# EAGLE design Camera-Board (EAGLE 8.0.0)

## Sheet 1 of 2: Template
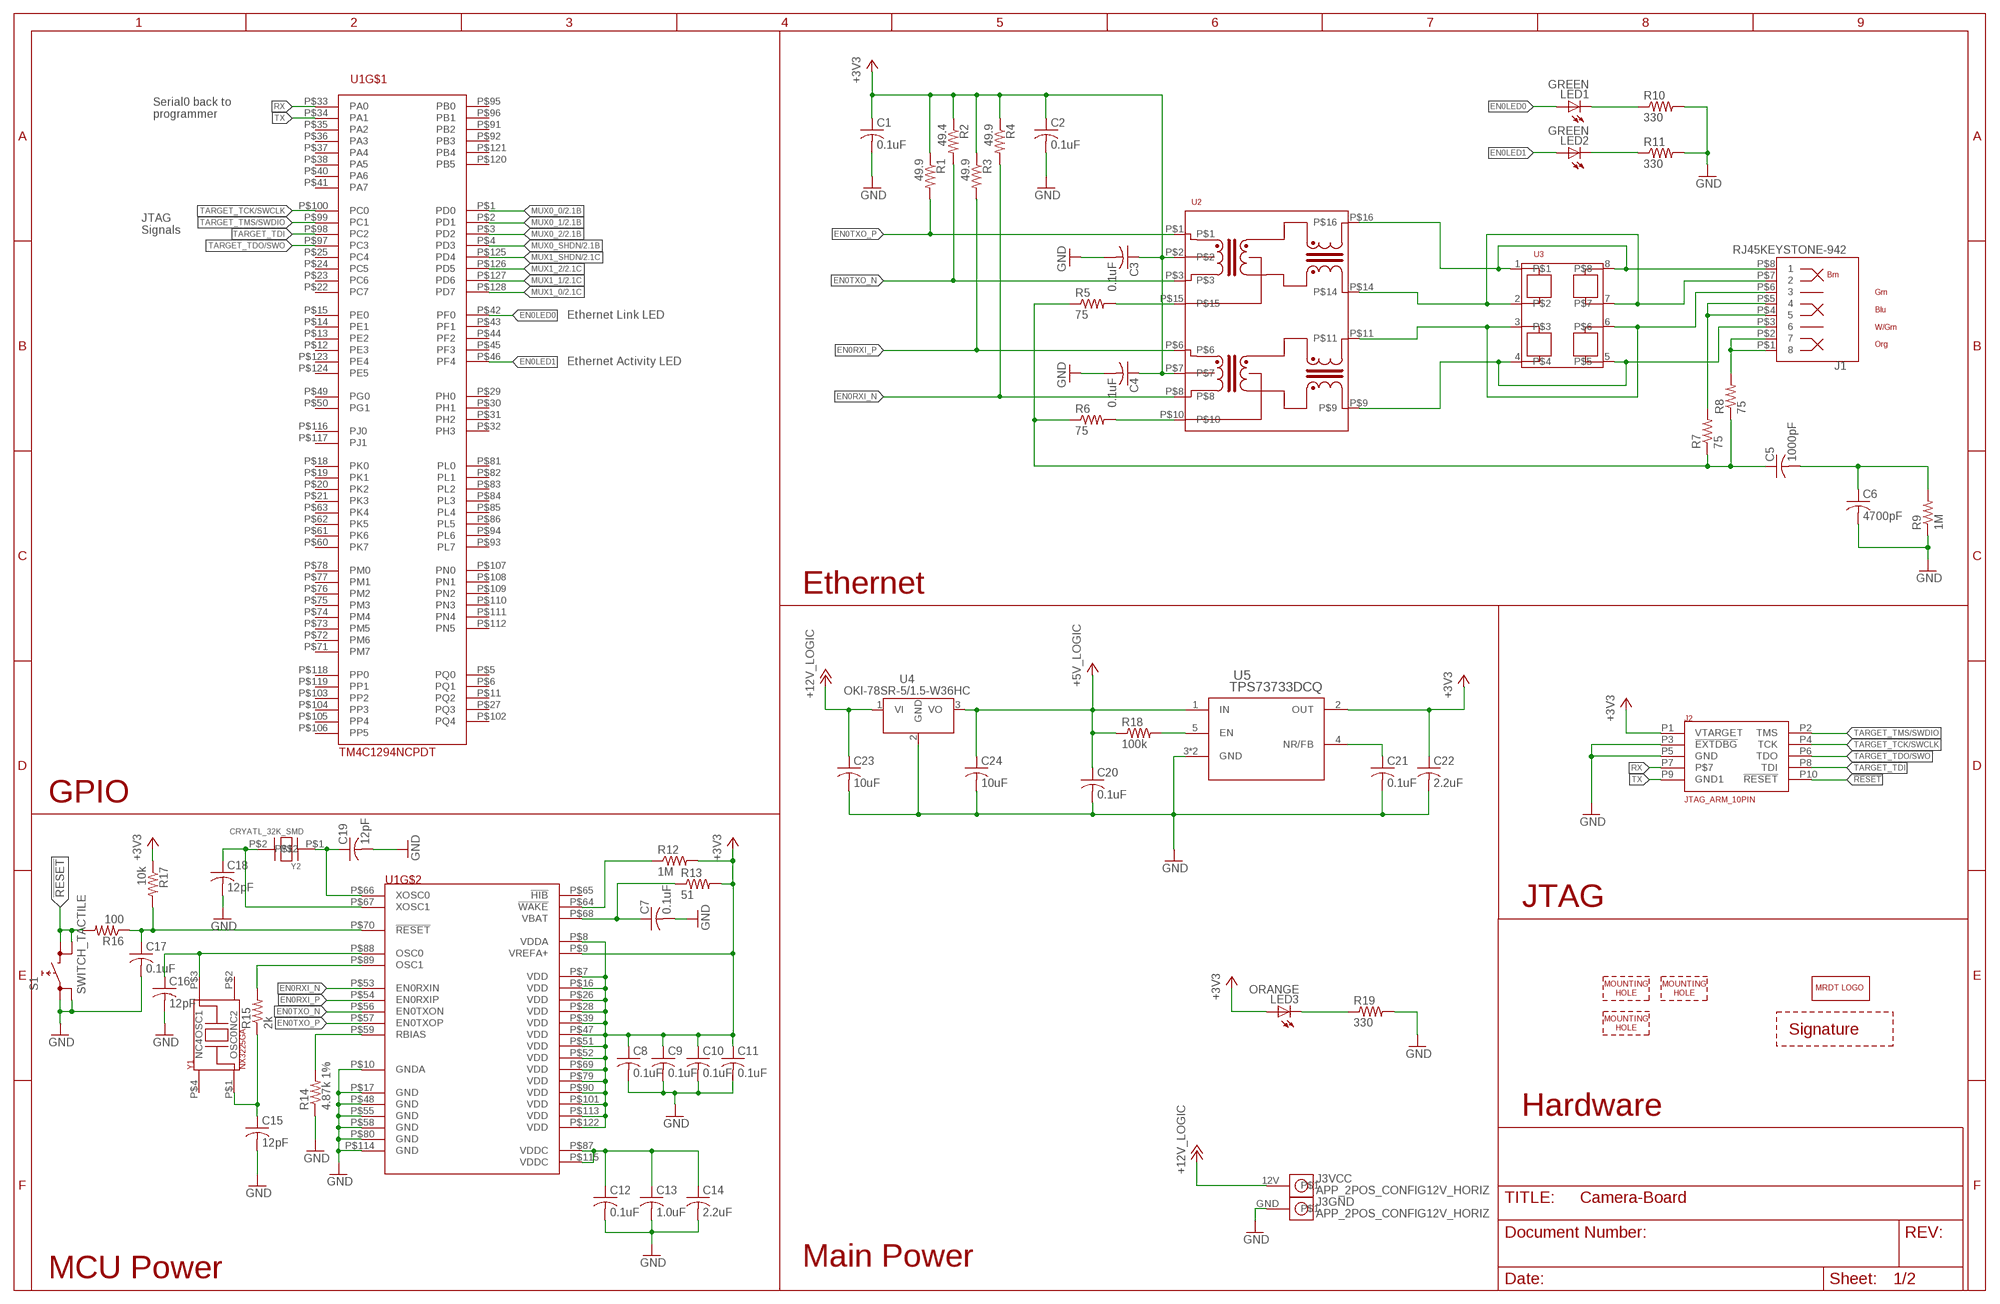
[diagram p0: schematic, sheet 1]

### Parts
C1  0.1uF  C-USC0603  [C0603]
C2  0.1uF  C-USC0603  [C0603]
C3  0.1uF  C-USC0603  [C0603]
C4  0.1uF  C-USC0603  [C0603]
C5  1000pF  C-USC0603  [C0603]
C6  4700pF  C-USC1206  [C1206]
C7  0.1uF  C-USC0603  [C0603]
C8  0.1uF  C-USC0603  [C0603]
C9  0.1uF  C-USC0603  [C0603]
C10  0.1uF  C-USC0603  [C0603]
C11  0.1uF  C-USC0603  [C0603]
C12  0.1uF  C-USC0603  [C0603]
C13  1.0uF  C-USC0603  [C0603]
C14  2.2uF  C-USC0603  [C0603]
C15  12pF  C-USC0603  [C0603]
C16  12pF  C-USC0603  [C0603]
C17  0.1uF  C-USC0603  [C0603]
C18  12pF  C-USC0603  [C0603]
C19  12pF  C-USC0603  [C0603]
C20  0.1uF  C-USC0603  [C0603]
C21  0.1uF  C-USC0603  [C0603]
C22  2.2uF  C-USC0603  [C0603]
C23  10uF  C-USC1206  [C1206]
C24  10uF  C-USC1206  [C1206]
J1  RJ45KEYSTONE-942  [KEYSTONE-942]
J2  JTAG_ARM_10PIN  [CON_2X5_50MIL]
J3  APP_2POS_CONFIG12V_HORIZ  [APP45_12V_HORIZ_CONFIG]
LED1  GREEN  LEDCHIP-LED0603  [CHIP-LED0603]
LED2  GREEN  LEDCHIP-LED0603  [CHIP-LED0603]
LED3  ORANGE  LEDCHIP-LED0603  [CHIP-LED0603]
R1  49.9  R-US_R0603  [R0603]
R2  49.4  R-US_R0603  [R0603]
R3  49.9  R-US_R0603  [R0603]
R4  49.9  R-US_R0603  [R0603]
R5  75  R-US_R0603  [R0603]
R6  75  R-US_R0603  [R0603]
R7  75  R-US_R0603  [R0603]
R8  75  R-US_R0603  [R0603]
R9  1M  R-US_R1206  [R1206]
R10  330  R-US_R0603  [R0603]
R11  330  R-US_R0603  [R0603]
R12  1M  R-US_R0603  [R0603]
R13  51  R-US_R0603  [R0603]
R14  4.87k 1%  R-US_R0603  [R0603]
R15  2k  R-US_R0603  [R0603]
R16  100  R-US_R0603  [R0603]
R17  10k  R-US_R0603  [R0603]
R18  100k  R-US_R0603  [R0603]
R19  330  R-US_R0603  [R0603]
S1  SWITCH_TACTILE  [SWITCH_6MM_6MM_TE_CON_SMD]
U1  TM4C1294NCPDT  [TQFP-128]
U2  HX1198FNL  [HX1198FNL]
U3  SLVU2.8-4  [SOIC8]
U4  OKI-78SR-5/1.5-W36HC  [OKI-78SR_HORIZ]
U5  TPS73733DCQ  [SOT-223-6]
U$1  MRDT_LOGO  [MRDT_LOGO]
U$2  MOUNTING_HOLE#6  [#6_SCREW]
U$3  MOUNTING_HOLE#6  [#6_SCREW]
U$4  MOUNTING_HOLE#6  [#6_SCREW]
U$8  SIG3  [SIG3]
Y1  NX3225GA  [NDK3.2X2.5]
Y2  CRYATL_32K_SMD  [CRYSTAL_32K_SMD]

### Nets
!RESET: J2.P10(!RESET) R16.2 S1.P$3 S1.P$4
+3V3: C1.1 C2.1 C3.1 C4.1 C8.1 C9.1 C10.1 C11.1 C22.1 J2.P1(VTARGET) LED3.A R1.1 R2.1 R3.1 R4.1 R12.2 R13.2 R17.1 U1.P$7(VDD) U1.P$8(VDDA) U1.P$9(VREFA+) U1.P$16(VDD) U1.P$26(VDD) U1.P$28(VDD) U1.P$39(VDD) U1.P$47(VDD) U1.P$51(VDD) U1.P$52(VDD) U1.P$69(VDD) U1.P$79(VDD) U1.P$90(VDD) U1.P$101(VDD) U1.P$113(VDD) U1.P$122(VDD) U2.P$2 U2.P$7 U5.2(OUT)
+5V_LOGIC: C20.1 C24.1 R18.1 U4.3(VO) U5.1(IN) ; also sheet 2
+12V_LOGIC: C23.1 J3.12V U4.1(VI)
EN0LED0: LED1.A U1.P$42(PF0)
EN0LED1: LED2.A U1.P$46(PF4)
EN0RXI_N [Ethernet]: R4.2 U1.P$53(EN0RXIN) U2.P$8
EN0RXI_P [Ethernet]: R3.2 U1.P$54(EN0RXIP) U2.P$6
EN0TXO_N [Ethernet]: R2.2 U1.P$56(EN0TXON) U2.P$3
EN0TXO_P [Ethernet]: R1.2 U1.P$57(EN0TXOP) U2.P$1
GND: C1.2 C2.2 C3.2 C4.2 C6.2 C7.2 C8.2 C9.2 C10.2 C11.2 C12.2 C13.2 C14.2 C15.2 C16.2 C17.2 C18.2 C19.2 C20.2 C21.2 C22.2 C23.2 C24.2 J2.P3(!EXTDBG) J2.P5(GND) J3.GND R9.1 R10.2 R11.2 R14.1 R19.2 S1.P$1 S1.P$2 U1.P$10(GNDA) U1.P$17(GND) U1.P$48(GND) U1.P$55(GND) U1.P$58(GND) U1.P$80(GND) U1.P$114(GND) U4.2(GND) U5.3(GND) U5.6(GND) ; also sheet 2
MUX0_0: U1.P$1(PD0) ; also sheet 2
MUX0_1: U1.P$2(PD1) ; also sheet 2
MUX0_2: U1.P$3(PD2) ; also sheet 2
MUX0_SHDN: U1.P$4(PD3) ; also sheet 2
MUX1_0: U1.P$128(PD7) ; also sheet 2
MUX1_1: U1.P$127(PD6) ; also sheet 2
MUX1_2: U1.P$126(PD5) ; also sheet 2
MUX1_SHDN: U1.P$125(PD4) ; also sheet 2
N_$1: R5.2 U2.P$15
N_$3: R6.2 U2.P$10
N_$4: J1.P$7 U2.P$14 U3.2 U3.7
N_$5: J1.P$6 U2.P$11 U3.3 U3.6
N_$6: J1.P$8 U2.P$16 U3.1 U3.8
N_$7: J1.P$3 U2.P$9 U3.4 U3.5
N_$8: LED2.C R11.1
N_$9: LED1.C R10.1
N_$10: C7.1 R13.1 U1.P$68(VBAT)
N_$11: J1.P$4 J1.P$5 R7.2
N_$12: R12.1 U1.P$64(!WAKE)
N_$13: J1.P$1 J1.P$2 R8.2
N_$14: C5.1 R5.1 R6.1 R7.1 R8.1
N_$15: C5.2 C6.1 R9.2
N_$16: C12.1 C13.1 C14.1 U1.P$87(VDDC) U1.P$115(VDDC)
N_$17: R15.2 U1.P$89(OSC1)
N_$18: C16.1 U1.P$88(OSC0) Y1.P$3(OSC1)
N_$19: R14.2 U1.P$59(RBIAS)
N_$20: C17.1 R16.1 R17.2 U1.P$70(!RESET)
N_$21: C15.1 R15.1 Y1.P$1(OSC0)
N_$22: C18.1 U1.P$67(XOSC1) Y2.P$2
N_$23: C19.1 U1.P$66(XOSC0) Y2.P$1
N_$25: R18.2 U5.5(EN)
N_$26: LED3.C R19.1
N_$27: C21.1 U5.4(NR/FB)
RX: J2.P7 U1.P$33(PA0)
TARGET_TCK/SWCLK: J2.P4(TCK) U1.P$100(PC0)
TARGET_TDI: J2.P8(TDI) U1.P$98(PC2)
TARGET_TDO/SWO: J2.P6(TDO) U1.P$97(PC3)
TARGET_TMS/SWDIO: J2.P2(TMS) U1.P$99(PC1)
TX: J2.P9(GND1) U1.P$34(PA1)
Unconnected: U1.P$5(PQ0) U1.P$6(PQ1) U1.P$11(PQ2) U1.P$12(PE3) U1.P$13(PE2) U1.P$14(PE1) U1.P$15(PE0) U1.P$18(PK0) U1.P$19(PK1) U1.P$20(PK2) U1.P$21(PK3) U1.P$22(PC7) U1.P$23(PC6) U1.P$24(PC5) U1.P$25(PC4) U1.P$27(PQ3) U1.P$29(PH0) U1.P$30(PH1) U1.P$31(PH2) U1.P$32(PH3) U1.P$35(PA2) U1.P$36(PA3) U1.P$37(PA4) U1.P$38(PA5) U1.P$40(PA6) U1.P$41(PA7) U1.P$43(PF1) U1.P$44(PF2) U1.P$45(PF3) U1.P$49(PG0) U1.P$50(PG1) U1.P$60(PK7) U1.P$61(PK6) U1.P$62(PK5) U1.P$63(PK4) U1.P$65(!HIB) U1.P$71(PM7) U1.P$72(PM6) U1.P$73(PM5) U1.P$74(PM4) U1.P$75(PM3) U1.P$76(PM2) U1.P$77(PM1) U1.P$78(PM0) U1.P$81(PL0) U1.P$82(PL1) U1.P$83(PL2) U1.P$84(PL3) U1.P$85(PL4) U1.P$86(PL5) U1.P$91(PB2) U1.P$92(PB3) U1.P$93(PL7) U1.P$94(PL6) U1.P$95(PB0) U1.P$96(PB1) U1.P$102(PQ4) U1.P$103(PP2) U1.P$104(PP3) U1.P$105(PP4) U1.P$106(PP5) U1.P$107(PN0) U1.P$108(PN1) U1.P$109(PN2) U1.P$110(PN3) U1.P$111(PN4) U1.P$112(PN5) U1.P$116(PJ0) U1.P$117(PJ1) U1.P$118(PP0) U1.P$119(PP1) U1.P$120(PB5) U1.P$121(PB4) U1.P$123(PE4) U1.P$124(PE5) Y1.P$2(NC2) Y1.P$4(NC4)

### Notes on the sheet
- Serial0 back to
  programmer
- JTAG
  Signals
- Ethernet Link LED
- Ethernet Activity LED
- Ethernet
- GPIO
- JTAG
- Hardware
- Main Power
- MCU Power

## Sheet 2 of 2: Camera Muxing
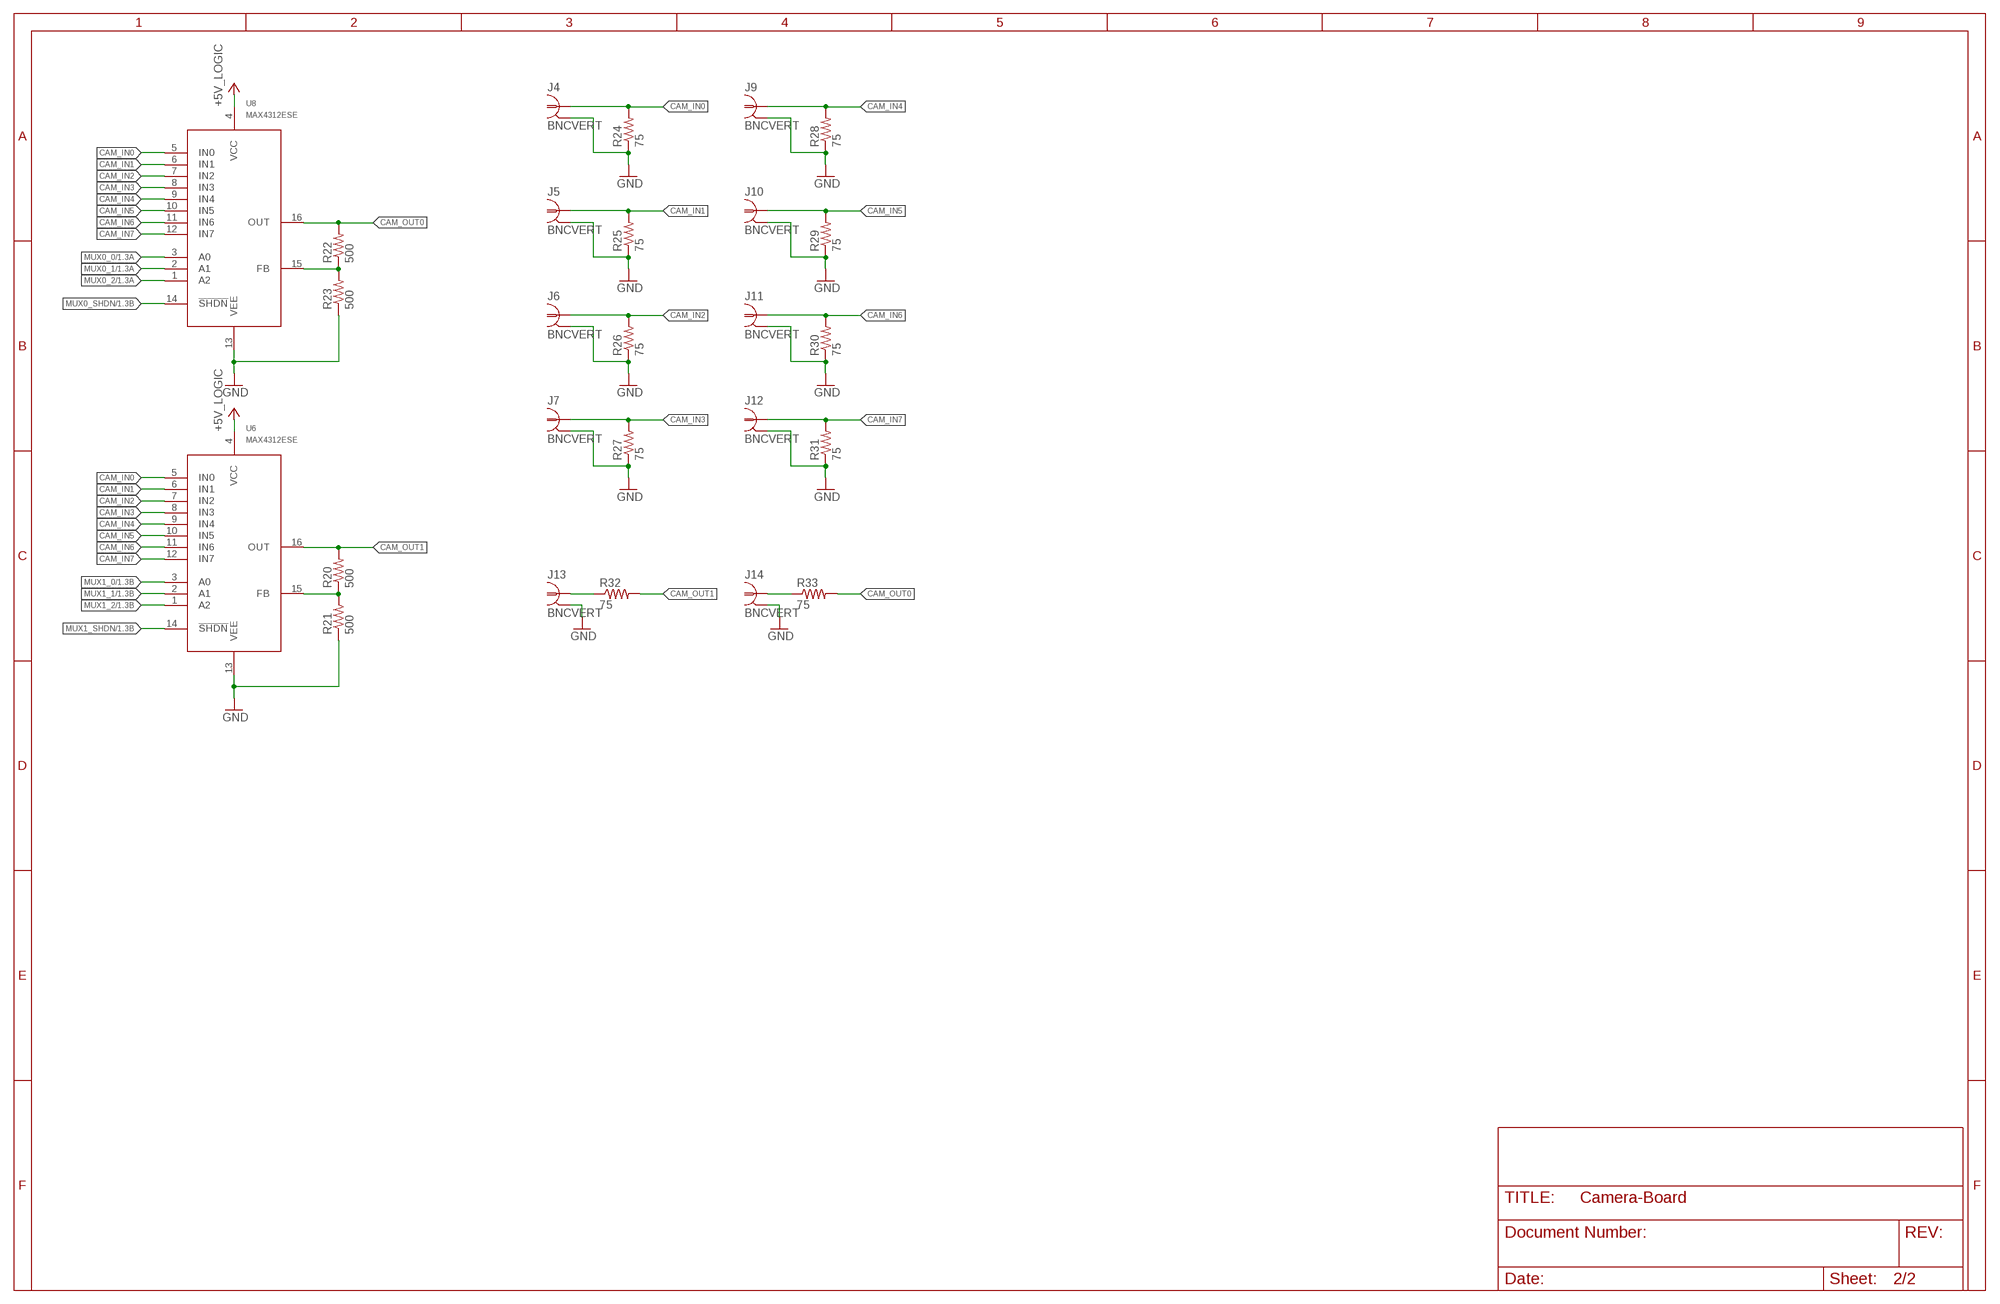
[diagram p1: schematic, sheet 2]

### Parts
J4  BNCVERT  [MOLEX-0731711900-BNC]
J5  BNCVERT  [MOLEX-0731711900-BNC]
J6  BNCVERT  [MOLEX-0731711900-BNC]
J7  BNCVERT  [MOLEX-0731711900-BNC]
J9  BNCVERT  [MOLEX-0731711900-BNC]
J10  BNCVERT  [MOLEX-0731711900-BNC]
J11  BNCVERT  [MOLEX-0731711900-BNC]
J12  BNCVERT  [MOLEX-0731711900-BNC]
J13  BNCVERT  [MOLEX-0731711900-BNC]
J14  BNCVERT  [MOLEX-0731711900-BNC]
R20  500  R-US_R0603  [R0603]
R21  500  R-US_R0603  [R0603]
R22  500  R-US_R0603  [R0603]
R23  500  R-US_R0603  [R0603]
R24  75  R-US_R0603  [R0603]
R25  75  R-US_R0603  [R0603]
R26  75  R-US_R0603  [R0603]
R27  75  R-US_R0603  [R0603]
R28  75  R-US_R0603  [R0603]
R29  75  R-US_R0603  [R0603]
R30  75  R-US_R0603  [R0603]
R31  75  R-US_R0603  [R0603]
R32  75  R-US_R0603  [R0603]
R33  75  R-US_R0603  [R0603]
U6  MAX4312ESE  [SOIC16]
U8  MAX4312ESE  [SOIC16]

### Nets
+5V_LOGIC: U6.4(VCC) U8.4(VCC) ; also sheet 1
CAM_IN0: J4.P$1 R24.2 U6.5(IN0) U8.5(IN0)
CAM_IN1: J5.P$1 R25.2 U6.6(IN1) U8.6(IN1)
CAM_IN2: J6.P$1 R26.2 U6.7(IN2) U8.7(IN2)
CAM_IN3: J7.P$1 R27.2 U6.8(IN3) U8.8(IN3)
CAM_IN4: J9.P$1 R28.2 U6.9(IN4) U8.9(IN4)
CAM_IN5: J10.P$1 R29.2 U6.10(IN5) U8.10(IN5)
CAM_IN6: J11.P$1 R30.2 U6.11(IN6) U8.11(IN6)
CAM_IN7: J12.P$1 R31.2 U6.12(IN7) U8.12(IN7)
CAM_OUT0: R22.2 R33.2 U8.16(OUT)
CAM_OUT1: R20.2 R32.2 U6.16(OUT)
GND: J4.P$2 J4.P$3 J4.P$4 J4.P$5 J5.P$2 J5.P$3 J5.P$4 J5.P$5 J6.P$2 J6.P$3 J6.P$4 J6.P$5 J7.P$2 J7.P$3 J7.P$4 J7.P$5 J9.P$2 J9.P$3 J9.P$4 J9.P$5 J10.P$2 J10.P$3 J10.P$4 J10.P$5 J11.P$2 J11.P$3 J11.P$4 J11.P$5 J12.P$2 J12.P$3 J12.P$4 J12.P$5 J13.P$2 J13.P$3 J13.P$4 J13.P$5 J14.P$2 J14.P$3 J14.P$4 J14.P$5 R21.1 R23.1 R24.1 R25.1 R26.1 R27.1 R28.1 R29.1 R30.1 R31.1 U6.13(VEE) U8.13(VEE) ; also sheet 1
MUX0_0: U8.3(A0) ; also sheet 1
MUX0_1: U8.2(A1) ; also sheet 1
MUX0_2: U8.1(A2) ; also sheet 1
MUX0_SHDN: U8.14(!SHDN) ; also sheet 1
MUX1_0: U6.3(A0) ; also sheet 1
MUX1_1: U6.2(A1) ; also sheet 1
MUX1_2: U6.1(A2) ; also sheet 1
MUX1_SHDN: U6.14(!SHDN) ; also sheet 1
N$1: R20.1 R21.2 U6.15(FB)
N$2: R22.1 R23.2 U8.15(FB)
N$3: J14.P$1 R33.1
N$4: J13.P$1 R32.1

## Library data of the parts
C1-C24 = resistor:C-US: CAPACITOR, American symbol
J1 = MRDT-Connectors:RJ45
J2 = MRDT-Connectors:JTAG_ARM_10PIN; PARTNO: M50-3600542
J3 = MRDT-Connectors:APP_2POS_CONFIG; COLOR1: YELLOW; COLOR2: BLACK
J4-J7 J9-J14 = MRDT-Connectors:BNC
LED1-LED3 = led:LED: LED OSRAM: - CHIPLED LG R971, LG N971, LY N971, LG Q971, LY Q971, LO R971, LY R971 LH N974, LH R974 LS Q976, LO Q976, LY Q976 LO Q996 - Hyper CHIPLED LW Q18S LB Q993, LB Q99A, LB R99A - SideLED LS A670, LO A670, LY A670, LG A670, LP A670 LB A673, LV A673, LT A673, LW A673 LH A674 LY A675 LS A676, LA A676, LO A676, LY A676, LW A676 LS A679, LY A679, LG A679 - Hyper Micro SIDELED® LS Y876, LA Y876, LO Y876, LY Y876 LT Y87S - SmartLED LW L88C, LW L88S LB L89C, LB L89S, LG L890 LS L89K, LO L89K, LY L89K LS L896, LA L896, LO L896, LY L896 - TOPLED LS T670, LO T670, LY T670, LG T670, LP T670 LSG T670, LSP T670, LSY T670, LOP T670, LYG T670 LG T671, LOG T671, LSG T671 LB T673, LV T673, LT T673, LW T673 LH T674 LS T676, LA T676, LO T676, LY T676, LB T676, LH T676, LSB T676, LW T676 LB T67C, LV T67C, LT T67C, LS T67K, LO T67K, LY T67K, LW E67C LS E67B, LA E67B, LO E67B, LY E67B, LB E67C, LV E67C, LT E67C LW T67C LS T679, LY T679, LG T679 LS T770, LO T770, LY T770, LG T770, LP T770 LB T773, LV T773, LT T773, LW T773 LH T774 LS E675, LA E675, LY E675, LS T675 LS T776, LA T776, LO T776, LY T776, LB T776 LHGB T686 LT T68C, LB T68C - Hyper Mini TOPLED® LB M676 - Mini TOPLED Santana® LG M470 LS M47K, LO M47K, LY M47K Source: http://www.osram.convergy.de LUXEON: - LUMILED® LXK2-PW12-R00, LXK2-PW12-S00, LXK2-PW14-U00, LXK2-PW14-V00 LXK2-PM12-R00, LXK2-PM12-S00, LXK2-PM14-U00 LXK2-PE12-Q00, LXK2-PE12-R00, LXK2-PE12-S00, LXK2-PE14-T00, LXK2-PE14-U00 LXK2-PB12-K00, LXK2-PB12-L00, LXK2-PB12-M00, LXK2-PB14-N00, LXK2-PB14-P00, LXK2-PB14-Q00 LXK2-PR12-L00, LXK2-PR12-M00, LXK2-PR14-Q00, LXK2-PR14-R00 LXK2-PD12-Q00, LXK2-PD12-R00, LXK2-PD12-S00 LXK2-PH12-R00, LXK2-PH12-S00 LXK2-PL12-P00, LXK2-PL12-Q00, LXK2-PL12-R00 Source: www.luxeon.com KINGBRIGHT: KA-3528ASYC Source: www.kingbright.com
R1 = rcl:R-US_: RESISTOR, American symbol
R2-R33 = resistor:R-US_: RESISTOR, American symbol
S1 = MRDT-UserInput:SWITCH_TACTILE
U1 = MRDT-Microcontrollers:TM4C1294NCPDT
U2 = MRDT-ICs:HX1198FNL
U3 = MRDT-ICs:SLVU2.8-4
U4 = MRDT-ICs:OKI-78SR-*/1.5-W36?C: 4.95W DC/DC Converter Manufacturer: Murata; VOUT: +5v
U5 = MRDT-ICs:TPS73733*: LDO with Reverse Current Protection
U6 U8 = MRDT-ICs:MAX4312E?E
U$1 = MRDT-Hardware:MRDT_LOGO
U$2-U$4 = MRDT-Hardware:MOUNTING_HOLE: Mounting hole for M6 bolt. Standard use mounting hole for: Tiva C Connected - M6 Anderson Powerpole Mounting Wing - M8 Most frame-mounted PCB's - M8
U$8 = sig:SIG
Y1 = MRDT-Passives:NX3225GA
Y2 = MRDT-Passives:CRYATL_32K_SMD

## Net classes
2 Ethernet: width 0.22 mm, clearance 0.152 mm

## Board
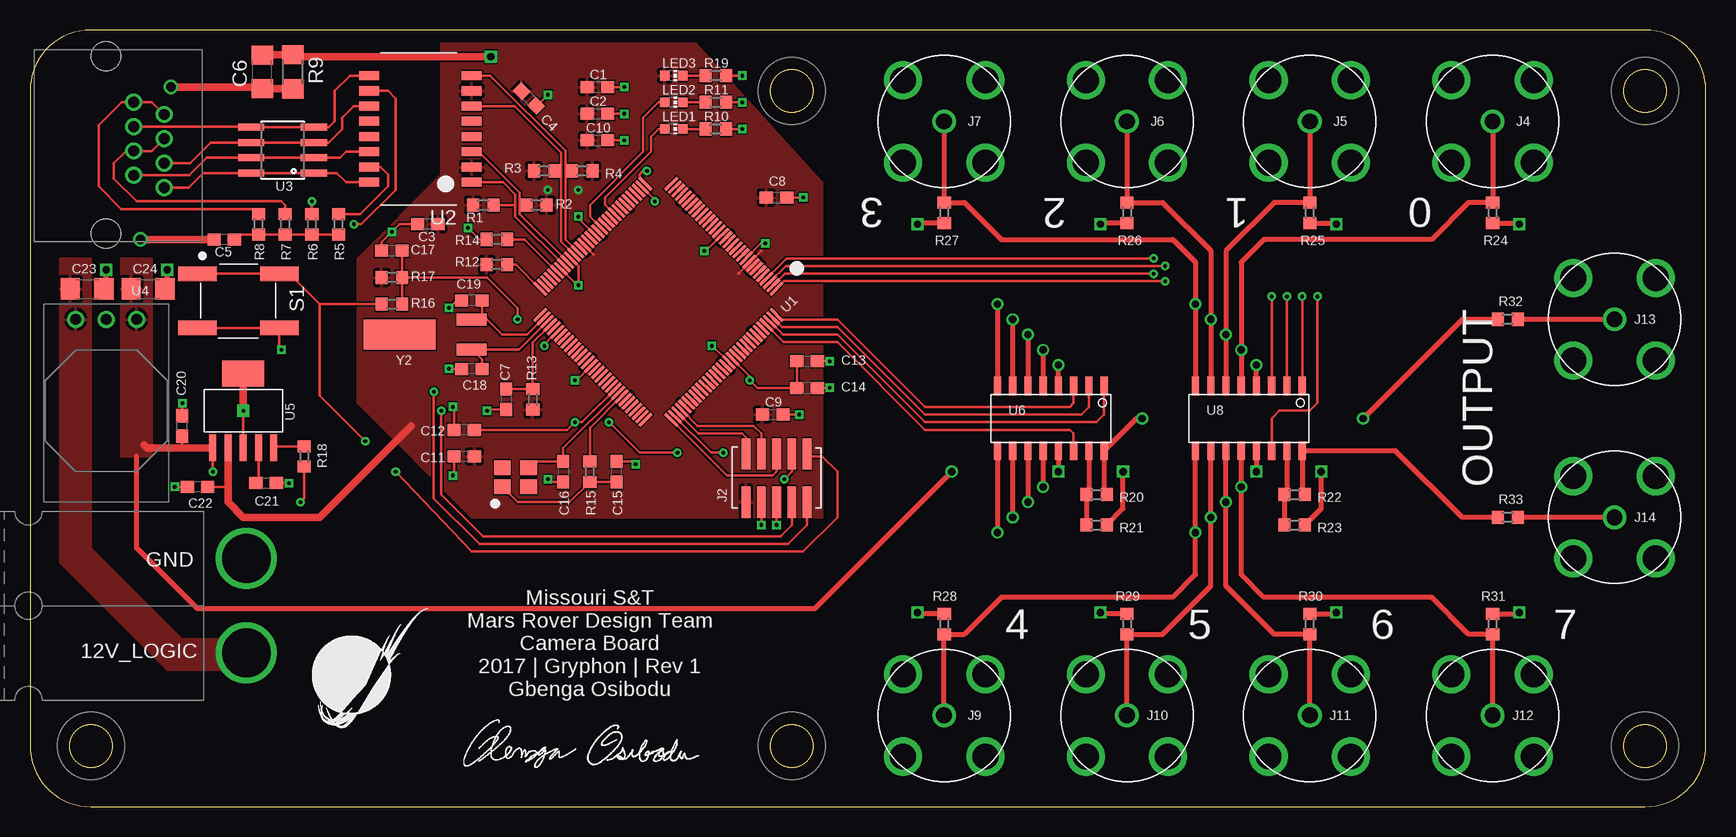
[diagram p2: board, top side]
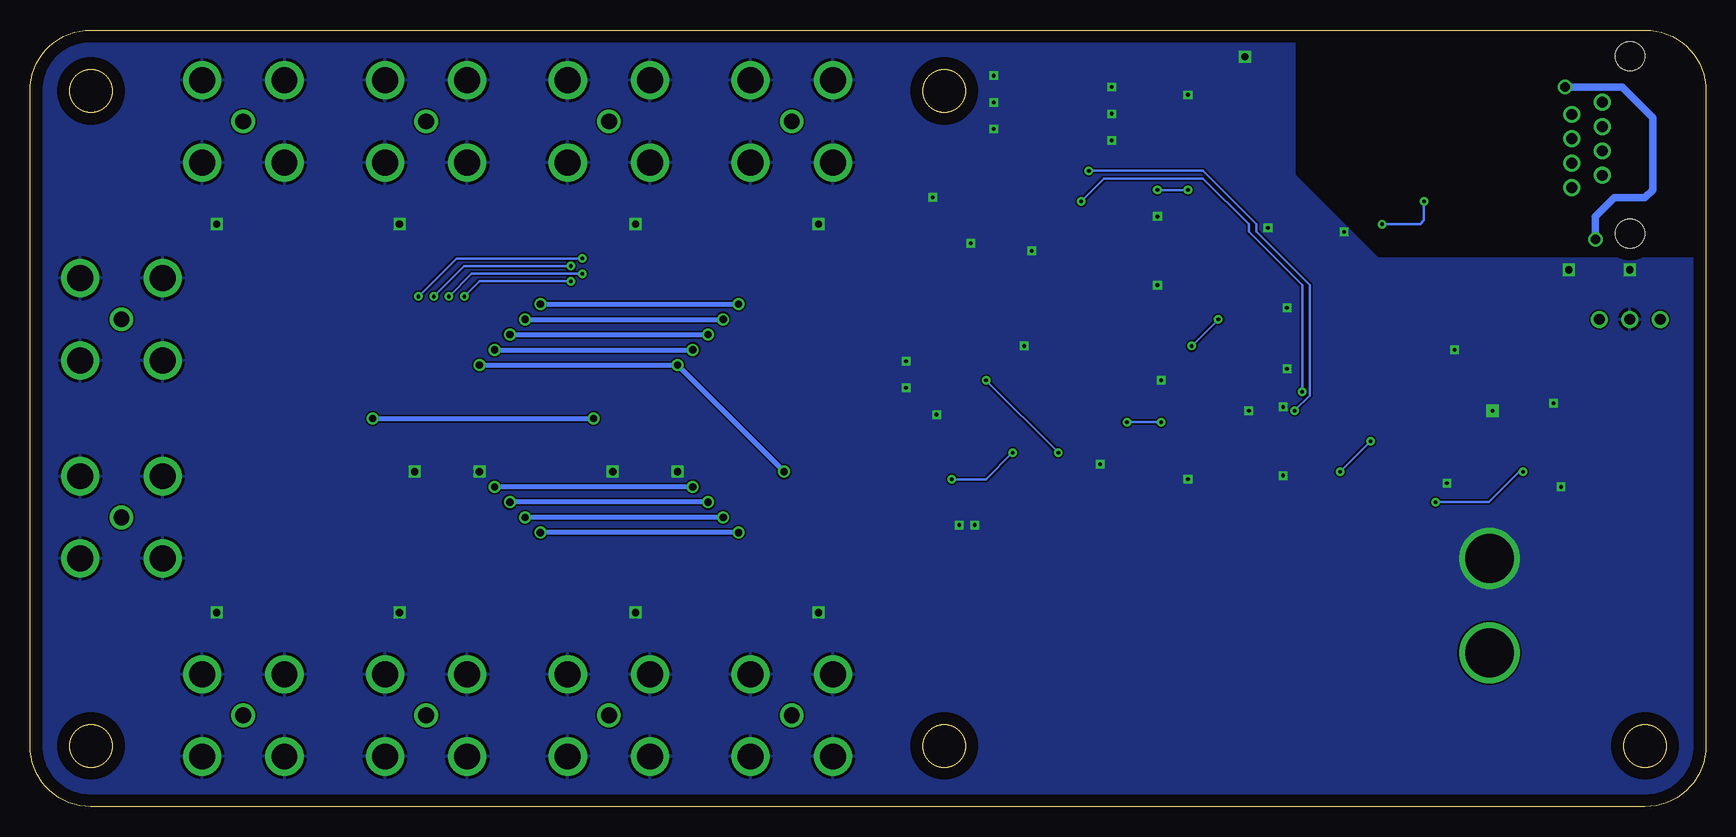
[diagram p3: board, bottom side, seen from below]

Size 139.7 x 64.77 mm. Coordinates in mm from the lower left corner, seen from the top.
Outline: 134.62,64.77 5.08,64.77 arc90 0,59.69 0,5.08 arc90 5.08,0 134.62,0 arc90 139.7,5.08 139.7,59.69 arc90 134.62,64.77
Copper layers (1*16): Top 0.035mm / dielectric 1.5mm / Bottom 0.035mm
Design rules "advanced_circuits_standard *": minimum track width 5mil, minimum drill 10mil, track to track 5mil, track to pad 5mil, pad to pad 5mil, via to via 5mil, smd to smd 5mil, copper to edge 40mil, drill to drill 5mil, minimum pad ring 10mil, minimum via ring 8mil, stop-mask expansion 4mil, vias tented up to drill 0mil, thermal gap 10mil

### Footprints (pad centres in the part's own frame; a part is rotated, then mirrored left to right if it is on the bottom)
C0603 = smd 1.1 x 1: 1 -0.85,0; 2 0.85,0
C1206 = smd 1.6 x 1.8: 1 -1.4,0; 2 1.4,0
KEYSTONE-942 = drill 0.9: P$1 3.8,2.289; P$2 4.816,4.829; P$3 5.832,2.289; P$4 6.848,4.829; P$5 7.864,2.289; P$6 8.88,4.829; P$7 9.896,2.289; P$8 10.912,4.829 | hole 2.413: -0.023,-0.023; 14.76,-0.023
CON_2X5_50MIL = smd 0.74 x 2.6: P1 0,0; P2 0,4.008; P3 1.27,0; P4 1.27,4.008; P5 2.54,0; P6 2.54,4.008; P7 3.81,0; P8 3.81,4.008; P9 5.08,0; P10 5.08,4.008
APP45_12V_HORIZ_CONFIG = drill 4.064: 12V 28.194,3.937; GND 28.194,11.811
MOLEX-0731711900-BNC = drill 1.32: P$1 0,0 | drill 2.16: P$2 -3.43,3.43; P$3 3.43,3.43; P$4 3.43,-3.43; P$5 -3.43,-3.43
CHIP-LED0603 = smd 0.8 x 0.8: A 0,-0.75; C 0,0.75
R0603 = smd 1 x 1.1: 1 -0.85,0; 2 0.85,0
R1206 = smd 1.6 x 1.803: 1 -1.422,0; 2 1.422,0
SWITCH_6MM_6MM_TE_CON_SMD = smd 1.2 x 3.2: P$1 4.521,6.807; P$2 4.521,0; P$3 0,6.807; P$4 0,0
TQFP-128 = smd 1.45 x 0.25: P$1 0,0; P$2 0,-0.4; P$3 0,-0.8; P$4 0,-1.2; P$5 0,-1.6; P$6 0,-2; P$7 0,-2.4; P$8 0,-2.8; P$9 0,-3.2; P$10 0,-3.6; P$11 0,-4; P$12 0,-4.4; P$13 0,-4.8; P$14 0,-5.2; P$15 0,-5.6; P$16 0,-6; P$17 0,-6.4; P$18 0,-6.8; P$19 0,-7.2; P$20 0,-7.6; P$21 0,-8; P$22 0,-8.4; P$23 0,-8.8; P$24 0,-9.2; P$25 0,-9.6; P$26 0,-10; P$27 0,-10.4; P$28 0,-10.8; P$29 0,-11.2; P$30 0,-11.6; P$31 0,-12; P$32 0,-12.4; P$65 15.45,-12.4; P$66 15.45,-12; P$67 15.45,-11.6; P$68 15.45,-11.2; P$69 15.45,-10.8; P$70 15.45,-10.4; P$71 15.45,-10; P$72 15.45,-9.6; P$73 15.45,-9.2; P$74 15.45,-8.8; P$75 15.45,-8.4; P$76 15.45,-8; P$77 15.45,-7.6; P$78 15.45,-7.2; P$79 15.45,-6.8; P$80 15.45,-6.4; P$81 15.45,-6; P$82 15.45,-5.6; P$83 15.45,-5.2; P$84 15.45,-4.8; P$85 15.45,-4.4; P$86 15.45,-4; P$87 15.45,-3.6; P$88 15.45,-3.2; P$89 15.45,-2.8; P$90 15.45,-2.4; P$91 15.45,-2; P$92 15.45,-1.6; P$93 15.45,-1.2; P$94 15.45,-0.8; P$95 15.45,-0.4; P$96 15.45,0 | smd 0.25 x 1.45: P$33 1.525,-13.925; P$34 1.925,-13.925; P$35 2.325,-13.925; P$36 2.725,-13.925; P$37 3.125,-13.925; P$38 3.525,-13.925; P$39 3.925,-13.925; P$40 4.325,-13.925; P$41 4.725,-13.925; P$42 5.125,-13.925; P$43 5.525,-13.925; P$44 5.925,-13.925; P$45 6.325,-13.925; P$46 6.725,-13.925; P$47 7.125,-13.925; P$48 7.525,-13.925; P$49 7.925,-13.925; P$50 8.325,-13.925; P$51 8.725,-13.925; P$52 9.125,-13.925; P$53 9.525,-13.925; P$54 9.925,-13.925; P$55 10.325,-13.925; P$56 10.725,-13.925; P$57 11.125,-13.925; P$58 11.525,-13.925; P$59 11.925,-13.925; P$60 12.325,-13.925; P$61 12.725,-13.925; P$62 13.125,-13.925; P$63 13.525,-13.925; P$64 13.925,-13.925; P$97 13.925,1.525; P$98 13.525,1.525; P$99 13.125,1.525; P$100 12.725,1.525; P$101 12.325,1.525; P$102 11.925,1.525; P$103 11.525,1.525; P$104 11.125,1.525; P$105 10.725,1.525; P$106 10.325,1.525; P$107 9.925,1.525; P$108 9.525,1.525; P$109 9.125,1.525; P$110 8.725,1.525; P$111 8.325,1.525; P$112 7.925,1.525; P$113 7.525,1.525; P$114 7.125,1.525; P$115 6.725,1.525; P$116 6.325,1.525; P$117 5.925,1.525; P$118 5.525,1.525; P$119 5.125,1.525; P$120 4.725,1.525; P$121 4.325,1.525; P$122 3.925,1.525; P$123 3.525,1.525; P$124 3.125,1.525; P$125 2.725,1.525; P$126 2.325,1.525; P$127 1.925,1.525; P$128 1.525,1.525
HX1198FNL = smd 0.76 x 1.67: P$1 0,0; P$2 1.27,0; P$3 2.54,0; P$4 3.81,0; P$5 5.08,0; P$6 6.35,0; P$7 7.62,0; P$8 8.89,0; P$9 8.89,8.55; P$10 7.62,8.55; P$11 6.35,8.55; P$12 5.08,8.55; P$13 3.81,8.55; P$14 2.54,8.55; P$15 1.27,8.55; P$16 0,8.55
SOIC8 = smd 0.6 x 2.2: 1 0.457,-0.813; 2 1.727,-0.813; 3 2.997,-0.813; 4 4.267,-0.813; 5 4.267,4.419; 6 2.997,4.419; 7 1.727,4.419; 8 0.457,4.419
OKI-78SR_HORIZ = drill 0.9 pad 1.422: 1 0,0; 2 -2.54,0; 3 -5.08,0
SOT-223-6 = smd 0.6 x 2.2: 1 -2.54,-3.1; 2 -1.27,-3.1; 3 0,-3.1; 4 1.27,-3.1; 5 2.54,-3.1 | smd 3.5 x 2.2: 6 0,3.1
SOIC16 = smd 0.6 x 1.55: 1 -4.445,-2.7; 2 -3.175,-2.7; 3 -1.905,-2.7; 4 -0.635,-2.7; 5 0.635,-2.7; 6 1.905,-2.7; 7 3.175,-2.7; 8 4.445,-2.7; 9 4.445,2.7; 10 3.175,2.7; 11 1.905,2.7; 12 0.635,2.7; 13 -0.635,2.7; 14 -1.905,2.7; 15 -3.175,2.7; 16 -4.445,2.7
NDK3.2X2.5 = smd 1.4 x 1.2: P$1 0,0; P$2 2.2,0; P$3 2.2,1.6; P$4 0,1.6
CRYSTAL_32K_SMD = smd 2.5 x 1: P$1 0,1.25; P$2 0,-1.25 | smd 6 x 2.5: P$3 -6,0

### Placement (x,y rotation side)
C1  47.31,60.01 0 top
C2  47.31,57.78 0 top
C3  33.15,48.58 180 top
C4  41.59,59.05 315 top
C5  16.19,47.31 180 top
C6  19.37,61.28 90 top
C7  39.69,33.97 270 top
C8  62.23,50.8 0 top
C9  61.91,32.7 0 top
C10  47.31,55.56 0 top
C11  36.2,29.21 180 top
C12  36.2,31.43 180 top
C13  64.77,37.15 0 top
C14  64.77,34.92 0 top
C15  48.9,27.94 90 top
C16  44.45,27.94 270 top
C17  30.16,46.35 180 top
C18  36.83,36.51 180 top
C19  36.83,42.23 180 top
C20  12.7,31.75 90 top
C21  19.68,26.99 0 top
C22  13.97,26.67 180 top
C23  4.76,43.18 0 top
C24  9.84,43.18 0 top
J1  6.35,62.55 270 top
J2  59.69,25.4 0 top
J3  -10.16,8.89 0 top
J4  121.92,57.15 180 top
J5  106.68,57.15 180 top
J6  91.44,57.15 180 top
J7  76.2,57.15 180 top
J9  76.2,7.62 0 top
J10  91.44,7.62 0 top
J11  106.68,7.62 0 top
J12  121.92,7.62 0 top
J13  132.08,40.64 90 top
J14  132.08,24.13 90 top
LED1  53.66,56.52 270 top
LED2  53.66,58.74 270 top
LED3  53.66,60.96 270 top
R1  37.78,50.16 0 top
R2  42.23,50.16 180 top
R3  42.86,53.02 0 top
R4  46.04,53.02 180 top
R5  25.72,48.58 90 top
R6  23.5,48.58 90 top
R7  21.27,48.58 90 top
R8  19.05,48.58 90 top
R9  21.91,61.28 270 top
R10  57.15,56.52 0 top
R11  57.15,58.74 0 top
R12  38.93,45.21 180 top
R13  41.91,33.97 270 top
R14  38.93,47.31 0 top
R15  46.67,27.94 90 top
R16  30.16,41.91 180 top
R17  30.16,44.13 0 top
R18  22.86,29.21 90 top
R19  57.15,60.96 0 top
R20  88.9,26.04 0 top
R21  88.9,23.5 180 top
R22  105.41,26.04 0 top
R23  105.41,23.5 180 top
R24  121.92,49.53 90 top
R25  106.68,49.53 90 top
R26  91.44,49.53 90 top
R27  76.2,49.53 90 top
R28  76.2,15.24 270 top
R29  91.44,15.24 270 top
R30  106.68,15.24 270 top
R31  121.92,15.24 270 top
R32  123.19,40.64 180 top
R33  123.19,24.13 180 top
S1  13.97,44.45 270 top
U1  62.23,43.18 225 top
U2  36.83,52.07 90 top
U3  22.86,52.39 90 top
U4  3.81,40.64 180 top
U5  17.78,33.02 0 top
U6  85.09,32.38 180 top
U8  101.6,32.38 180 top
U$1  23.5,5.71 0 top
U$2  134.62,5.08 0 top
U$3  5.08,5.08 0 top
U$4  134.62,59.69 0 top
U$6  MOUNTING_HOLE#6  [#6_SCREW]  63.5,59.69 0 top
U$7  MOUNTING_HOLE#6  [#6_SCREW]  63.5,5.08 0 top
U$8  35.56,2.54 0 top
Y1  39.37,26.67 0 top
Y2  36.83,39.37 0 top

### Tracks (layer width: path | path; a pad name or v marks a point on that pad's centre or on a via)
!RESET  (via drill 0.3)
  Top 0.203: J2.P10 64.97,29.21 66.04,29.21 67.31,27.94 67.31,24.13 64.45,21.27 36.83,21.27 v30.48,27.94 | v27.94,30.48 24.13,34.29 24.13,41.91 | R16.2 24.13,41.91 | 24.13,41.91 21.59,44.45 S1.P$3 S1.P$4
  Bottom 0.203: v30.48,27.94 v27.94,30.48
+3V3  (via drill 0.3)
  Top 0.203: C22.1 16.51,26.67 | U1.P$51 46.21,46.81 46.99,46.04 | U1.P$9 60.05,45.44 | 60.05,45.44 60.96,46.35 | 60.05,45.44 59.05,44.45
  Top 0.61: U5.2 16.51,26.67 16.51,25.4 17.78,24.13 24.13,24.13 31.75,31.75
  Bottom 0.203: v43.18,51.44 v45.72,51.44
  pour Top: 34.29,66.04 34.29,52.7 27.3,45.72 27.3,33.66 36.83,24.13 66.04,24.13 66.04,52.07 53.34,66.04
+5V_LOGIC  (via drill 0.3, 0.6)
  Top 0.203: C20.1 12.7,29.92 | R18.1 22.86,25.72 v22.54,25.4 | v15.24,27.94 U5.1
  Top 0.406: U6.4 v85.72,36.83 | 8.89,29.21 8.89,21.59 13.97,16.51 65.41,16.51 v76.83,27.94 | U8.4 v102.23,36.83
  Top 0.61: U5.1 12.7,29.92 9.77,29.92 9.53,30.16
  Bottom 0.203: v22.54,25.4 18.1,25.4 15.56,27.94 v15.24,27.94
  Bottom 0.406: v76.83,27.94 v85.72,36.83 v102.23,36.83
  pour Top: 7.62,45.72 7.62,29.21 10.16,29.21 10.16,45.72
+12V_LOGIC
  pour Top: 2.54,45.72 5.08,45.72 5.08,21.59 12.7,13.97 19.05,13.97 19.05,11.43 11.43,11.43 2.54,20.32
CAM_IN0  (via drill 0.6)
  Top 0.406: U8.5 v100.97,38.1 100.97,45.4 102.87,47.31 116.84,47.31 119.91,50.38 R24.2 | v84.45,38.1 U6.5 | J4.P$1 R24.2 | R24.2 121.82,50.48
  Bottom 0.406: v100.97,38.1 v84.45,38.1
CAM_IN1  (via drill 0.6)
  Top 0.406: U8.6 v99.69,39.37 99.69,46.35 103.72,50.38 R25.2 | v83.19,39.37 U6.6 | J5.P$1 R25.2 | R25.2 106.58,50.48
  Bottom 0.406: v99.69,39.37 v83.19,39.37
CAM_IN2  (via drill 0.6)
  Top 0.406: U8.7 v98.42,40.64 98.42,46.35 94.4,50.38 R26.2 | v81.92,40.64 U6.7 | J6.P$1 R26.2 | 91.54,50.38 R26.2
  Bottom 0.406: v98.42,40.64 v81.92,40.64
CAM_IN3  (via drill 0.6)
  Top 0.406: U8.8 v97.16,41.91 97.16,45.4 95.25,47.31 80.96,47.31 77.89,50.38 R27.2 J7.P$1 | v80.64,41.91 U6.8
  Bottom 0.406: v97.16,41.91 v80.64,41.91
CAM_IN4  (via drill 0.6)
  Top 0.406: U6.9 v80.64,22.86 | U8.9 v97.16,22.86 97.16,19.37 95.25,17.46 80.96,17.46 77.89,14.39 R28.2 J9.P$1
  Bottom 0.406: v80.64,22.86 v97.16,22.86
CAM_IN5  (via drill 0.6)
  Top 0.406: U6.10 v81.92,24.13 | U8.10 v98.42,24.13 98.42,18.41 94.4,14.39 R29.2 J10.P$1
  Bottom 0.406: v81.92,24.13 v98.42,24.13
CAM_IN6  (via drill 0.6)
  Top 0.406: U6.11 v83.19,25.4 | U8.11 v99.69,25.4 99.69,18.41 103.72,14.39 R30.2 | J11.P$1 R30.2 | R30.2 106.58,14.29
  Bottom 0.406: v83.19,25.4 v99.69,25.4
CAM_IN7  (via drill 0.6)
  Top 0.406: U6.12 v84.45,26.67 | U8.12 v100.97,26.67 100.97,19.37 102.87,17.46 116.84,17.46 119.91,14.39 R31.2 J12.P$1
  Bottom 0.406: v84.45,26.67 v100.97,26.67
CAM_OUT0
  Top 0.406: R22.2 106.05,26.25 U8.16 113.83,29.68 119.38,24.13 R33.2
CAM_OUT1  (via drill 0.6)
  Top 0.406: R20.2 89.53,26.25 U6.16 92.23,32.38 v92.71,32.38 | R32.2 119.38,40.64 v111.12,32.38
  Bottom 0.406: v111.12,32.38 v92.71,32.38
EN0LED0
  Top 0.203: U1.P$42 47.94,50.22 47.94,50.8 51.75,54.61 51.75,55.88 52.39,56.52 LED1.A
EN0LED1
  Top 0.203: U1.P$46 46.67,49.23 46.67,50.16 51.12,54.61 51.12,57.47 52.39,58.74 LED2.A
EN0RXI_N
  Top 0.22: 44.64,53.02 44.64,47.3 U1.P$53 | 44.64,53.02 44.64,54.69 38.36,60.96 U2.P$8 | R4.2 44.64,53.02
EN0RXI_P
  Top 0.22: 44.26,53.02 44.26,47.11 U1.P$54 | 44.26,53.02 44.26,54.53 40.38,58.42 U2.P$6 | R3.2 44.26,53.02
EN0TXO_N
  Top 0.22: U1.P$56 40.83,49.42 40.83,50.16 | 40.83,50.16 40.83,51.2 37.41,54.61 U2.P$3 | R2.2 40.83,50.16
EN0TXO_P
  Top 0.22: U1.P$57 40.45,49.22 40.45,50.16 | 40.45,50.16 40.45,51.04 39.42,52.07 U2.P$1 | R1.2 40.45,50.16
GND  (via drill 0.3, 0.3 pad 1.02, 0.6)
  Top 0.203: C20.2 v12.7,33.66 | C22.2 v12.06,26.67 | U1.P$58 45.61,43.5 v45.72,43.5 45.72,45.09 U1.P$55 | U1.P$48 45.72,49.05 v45.72,49.21 | U1.P$17 56.35,46.35 v56.2,46.35 | C18.2 v34.92,36.51 | C19.2 35.56,42.23 v34.92,41.59 | C9.2 v64.14,32.7 | U1.P$114 56.92,38.42 v56.83,38.42 | U5.3 v17.78,33.02 | C4.2 42.4,58.59 v43.18,59.37 | C21.2 v21.59,26.99 | U1.P$80 45.56,35.56 v45.4,35.56 | C17.2 29.31,47.09 v30.16,47.94 30.8,48.58 C3.2 | C16.2 43.4,27.09 v43.18,27.3 | C15.2 50.27,28.79 v50.48,28.57 | R14.1 37.47,47.31 v36.51,48.26 | S1.P$2 S1.P$1 20.78,38.28 v20.95,38.1 | C7.2 38.2,33.12 v38.1,33.02 | C12.2 35.34,33.23 v35.24,33.34 | C11.2 35.34,27.73 v35.24,27.62 | C14.2 v66.67,34.92 | C13.2 v66.67,37.15 | U1.P$10 60.95,46.99 v61.28,46.99 | R10.2 v59.37,56.52 | R11.2 v59.37,58.74 | R19.2 v59.37,60.96 | C10.2 v49.53,55.56 | C2.2 v49.53,57.78 | C1.2 v49.53,60.01 | C8.2 v64.45,50.8 | J2.P3 v60.96,23.5 | J2.P5 v62.23,23.5
  Top 0.406: C23.2 6.35,43.18 v6.35,44.77 | C24.2 11.43,43.18 v11.43,44.77 | U6.13 v85.72,27.94 | U8.13 v102.23,27.94 | R28.1 73.98,16.09 v73.98,16.19 | R29.1 89.22,16.09 v89.22,16.19 | R30.1 108.9,16.09 v108.9,16.19 | R31.1 124.14,16.09 v124.14,16.19 | R24.1 124.14,48.68 v124.14,48.58 | R25.1 108.9,48.68 v108.9,48.58 | R26.1 89.22,48.68 v89.22,48.58 | R27.1 73.98,48.68 v73.98,48.58 | R21.1 91.12,24.87 v91.12,27.94 | R23.1 107.63,24.87 v107.63,27.94
  Top 0.61: U5.6 v17.78,33.02 | C6.2 19.39,62.7 R9.1 22.06,62.55 v38.42,62.55
  pour Bottom: -1.27,-2.54 -1.27,45.72 27.3,45.72 34.29,52.7 34.29,67.31 142.24,67.31 142.24,-2.54
MUX0_0  (via drill 0.3)
  Top 0.203: U1.P$1 62.87,43.81 v94.61,43.81 | v103.5,42.55 U8.3
  Bottom 0.203: v94.61,43.81 102.23,43.81 v103.5,42.55
MUX0_1  (via drill 0.3)
  Top 0.203: U1.P$2 62.93,44.45 v93.66,44.45 | v104.78,42.55 U8.2
  Bottom 0.203: v93.66,44.45 102.87,44.45 v104.78,42.55
MUX0_2  (via drill 0.3)
  Top 0.203: U1.P$3 63,45.09 v94.61,45.09 | v106.05,42.55 U8.1
  Bottom 0.203: v94.61,45.09 103.5,45.09 v106.05,42.55
MUX0_SHDN  (via drill 0.3)
  Top 0.203: U1.P$4 63.07,45.72 v93.66,45.72 | v107.31,42.55 107.31,33.66 106.68,33.02 104.14,33.02 103.5,32.38 U8.14
  Bottom 0.203: v93.66,45.72 104.14,45.72 v107.31,42.55
MUX1_0
  Top 0.203: U1.P$128 62.61,40.64 67.31,40.64 74.61,33.34 86.68,33.34 87,33.66 U6.3
MUX1_1
  Top 0.203: U1.P$127 62.68,40.01 67.31,40.01 74.61,32.7 87.63,32.7 88.27,33.34 U6.2
MUX1_2
  Top 0.203: U1.P$126 62.75,39.37 67.31,39.37 74.61,32.07 88.9,32.07 89.53,32.7 U6.1
MUX1_SHDN
  Top 0.203: U1.P$125 62.82,38.73 67.31,38.73 74.61,31.43 86.68,31.43 87,31.11 U6.14
N$1
  Top 0.406: U6.15 88.27,26.25 R20.1 R21.2
N$2
  Top 0.406: U8.15 104.78,26.25 R22.1 R23.2
N$3
  Top 0.406: J14.P$1 R33.1
N$4
  Top 0.406: J13.P$1 R32.1
N_$1
  Top 0.203: U2.P$15 29.21,53.34 29.84,52.7 29.84,51.75 27.52,49.43 R5.2
N_$3  (via drill 0.3)
  Top 0.203: R6.2 v23.5,50.48 | v26.99,48.58 27.62,48.58 30.48,51.44 30.48,59.05 29.84,59.69 U2.P$10
  Bottom 0.203: v23.5,50.48 23.5,48.9 23.81,48.58 v26.99,48.58
N_$4
  Top 0.203: J1.P$7 13.28,52.65 14.74,54.11 U3.7 U3.2 25.86,54.11 26.35,54.61 U2.P$14
N_$5
  Top 0.203: J1.P$6 13.35,53.67 15.06,55.38 U3.6 U3.3 24.9,55.38 26.04,56.52 26.04,57.47 26.99,58.42 U2.P$11
N_$6
  Top 0.203: J1.P$8 13.22,51.64 14.43,52.84 U3.8 U3.1 25.58,52.84 26.35,52.07 U2.P$16
N_$7
  Top 0.203: J1.P$3 18.38,56.72 U3.5 U3.4 24.9,56.65 25.4,57.15 25.4,59.69 26.67,60.96 U2.P$9
N_$8
  Top 0.203: LED2.C R11.1
N_$9
  Top 0.203: LED1.C R10.1
N_$10
  Top 0.203: C7.1 R13.1 41.91,38.7 U1.P$68
N_$11
  Top 0.203: J1.P$4 10.16,54.68 J1.P$5 8.01,54.68 6.99,53.66 6.99,52.39 8.89,50.48 20.95,50.48 21.27,50.16 R7.2
N_$12
  Top 0.203: U1.P$64 40.51,45.21 R12.1
N_$13
  Top 0.203: J1.P$2 10.16,58.75 J1.P$1 7.63,58.75 5.71,56.83 5.71,51.75 7.62,49.85 18.63,49.85 R8.2
N_$14
  Top 0.203: R5.1 R6.1 R7.1 R8.1 17.46,47.73 C5.1
N_$15  (via drill 0.8)
  Top 0.61: C5.2 v9.21,47.31 | R9.2 19.39,59.85 C6.1 19.24,60.01 v11.75,60.01
  Bottom 0.61: v11.75,60.01 6.99,60.01 4.45,57.47 4.45,51.44 5.08,50.8 7.62,50.8 9.21,49.21 v9.21,47.31
N_$16  (via drill 0.3)
  Top 0.203: 46.99,33.02 48.26,34.29 48.26,34.3 U1.P$87 46.03,32.07 v45.4,32.07 44.77,31.43 C12.1 | v48.26,32.07 50.8,29.53 v53.98,29.53 | U1.P$115 58.55,37.33 60.01,35.88 v60.01,35.56 60.64,34.92 C14.1 C13.1
  Bottom 0.203: v45.4,32.07 v48.26,32.07 | v53.98,29.53 v60.01,35.56
N_$17
  Top 0.203: U1.P$89 46.67,31.58 R15.2
N_$18
  Top 0.203: U1.P$88 44.45,29.93 C16.1 42.09,28.79 Y1.P$3
N_$19
  Top 0.203: U1.P$59 41.24,47.31 R14.2
N_$20  (via drill 0.3)
  Top 0.203: v42.86,38.42 42.86,38.52 U1.P$70 | v40.64,40.64 40.64,41.59 38.1,44.13 R17.2 | R16.1 R17.2 | R17.2 C17.1
  Bottom 0.203: v40.64,40.64 v42.86,38.42
N_$21
  Top 0.203: Y1.P$1 40.64,25.4 44.98,25.4 R15.1 C15.1
N_$22
  Top 0.203: U1.P$67 40.77,38.12 Y2.P$2 37.68,37.27 C18.1
N_$23
  Top 0.203: 38.12,40.62 Y2.P$1 | 38.12,40.62 39.37,39.37 41.45,39.37 U1.P$66 | C19.1 37.68,41.06 38.12,40.62
N_$25
  Top 0.203: U5.5 20.38,29.86 20.58,30.06 R18.2
N_$26
  Top 0.203: LED3.C R19.1
N_$27
  Top 0.203: 19.04,29.2 19.05,29.21 | 19.05,29.21 U5.4 | C21.1 19.05,27.2 19.05,29.21
RX  (via drill 0.3)
  Top 0.203: U1.P$33 50.8,52.45 50.8,52.7 51.12,53.02 v51.44,53.02 | v34.29,33.02 34.29,26.04 37.78,22.54 62.55,22.54 63.5,23.5 J2.P7
  Bottom 0.203: v51.44,53.02 41.91,53.02 37.47,48.58 37.47,47.94 33.02,43.5 33.02,34.29 v34.29,33.02
TARGET_TCK/SWCLK
  Top 0.203: J2.P4 60.96,31.11 60.33,31.75 55.66,31.75 U1.P$100
TARGET_TDI  (via drill 0.3)
  Top 0.203: J2.P8 63.5,27.94 v62.87,27.3 | v57.78,29.53 56.76,29.53 U1.P$98
  Bottom 0.203: v62.87,27.3 60.01,27.3 v57.78,29.53
TARGET_TDO/SWO
  Top 0.203: J2.P6 62.23,27.94 61.91,27.62 58.09,27.62 U1.P$97
TARGET_TMS/SWDIO
  Top 0.203: J2.P2 59.69,30.8 59.37,31.11 55.73,31.11 U1.P$99
TX  (via drill 0.3)
  Top 0.203: v33.66,34.61 33.66,25.72 37.47,21.91 63.18,21.91 64.77,23.5 J2.P9 | U1.P$34 52.07,50.62 v52.07,50.48
  Bottom 0.203: v33.66,34.61 33.66,43.5 38.1,47.94 38.1,48.58 41.91,52.39 50.16,52.39 v52.07,50.48

### Text on the board
tPlace: 3 | 2 | 1 | 0 | OUTPUT | GND | Missouri S&T / Mars Rover Design Team / Camera Board / 2017 | Gryphon | Rev 1 / Gbenga Osibodu | 4 | 5 | 6 | 7 | 12V_LOGIC